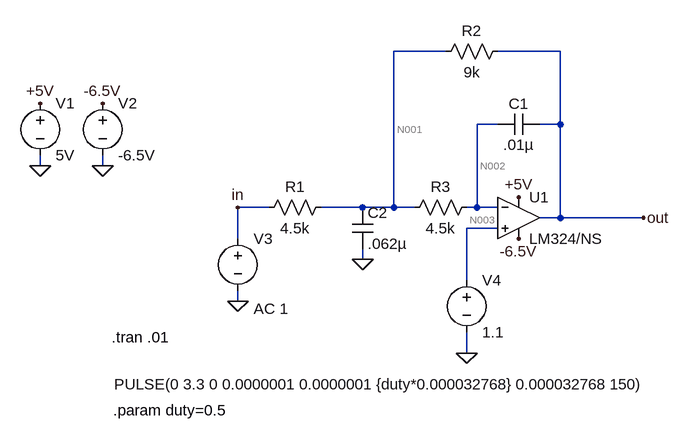
[diagram p0: schematic MFB_Duty_Sim.asc]
MFB_Duty_Sim.asc, the LTspice schematic file:
Version 4
SHEET 1 2296 768
WIRE 288 -32 208 -32
WIRE 464 -32 368 -32
WIRE 368 80 336 80
WIRE 464 80 464 -32
WIRE 464 80 432 80
WIRE -336 144 -336 128
WIRE -240 144 -240 128
WIRE 16 208 -32 208
WIRE 160 208 96 208
WIRE 208 208 208 -32
WIRE 208 208 160 208
WIRE 240 208 208 208
WIRE 336 208 336 80
WIRE 336 208 320 208
WIRE 368 208 336 208
WIRE 464 224 464 80
WIRE 464 224 432 224
WIRE 592 224 464 224
WIRE 368 240 320 240
WIRE -32 256 -32 208
WIRE 160 288 160 272
WIRE 320 320 320 240
WIRE -32 352 -32 336
WIRE 320 432 320 400
FLAG -240 144 0
FLAG -336 144 0
FLAG -336 48 +5V
FLAG 400 192 +5V
FLAG -240 48 -6.5V
FLAG 400 256 -6.5V
FLAG 160 288 0
FLAG -32 352 0
FLAG -32 208 in
FLAG 592 224 out
FLAG 320 432 0
SYMBOL ZZZ\\OpAmp\\LM324 400 224 R0
SYMATTR InstName U1
SYMBOL voltage -336 32 R0
WINDOW 123 0 0 Left 0
WINDOW 39 0 0 Left 0
SYMATTR InstName V1
SYMATTR Value 5V
SYMBOL voltage -240 32 R0
WINDOW 123 0 0 Left 0
WINDOW 39 0 0 Left 0
SYMATTR InstName V2
SYMATTR Value -6.5V
SYMBOL cap 432 64 R90
WINDOW 0 0 32 VBottom 2
WINDOW 3 32 32 VTop 2
SYMATTR InstName C1
SYMATTR Value .01µ
SYMBOL res 384 -48 R90
WINDOW 0 0 56 VBottom 2
WINDOW 3 32 56 VTop 2
SYMATTR InstName R2
SYMATTR Value 9k
SYMBOL res 336 192 R90
WINDOW 0 0 56 VBottom 2
WINDOW 3 32 56 VTop 2
SYMATTR InstName R3
SYMATTR Value 4.5k
SYMBOL cap 144 208 R0
SYMATTR InstName C2
SYMATTR Value .062µ
SYMBOL res 0 224 R270
WINDOW 0 32 56 VTop 2
WINDOW 3 0 56 VBottom 2
SYMATTR InstName R1
SYMATTR Value 4.5k
SYMBOL voltage -32 240 R0
WINDOW 3 -190 240 Left 2
WINDOW 123 24 124 Left 2
WINDOW 39 0 0 Left 0
SYMATTR InstName V3
SYMATTR Value PULSE(0 3.3 0 0.0000001 0.0000001 {duty*0.000032768} 0.000032768 150)
SYMATTR Value2 AC 1
SYMBOL voltage 320 304 R0
WINDOW 123 0 0 Left 0
WINDOW 39 0 0 Left 0
SYMATTR InstName V4
SYMATTR Value 1.1
TEXT -226 408 Left 2 !.tran .01
TEXT -224 520 Left 2 !.param duty=0.5

The netlist it stands for:
* MFB_Duty_Sim.asc
XU1 N003 N002 +5V -6.5V out LM324/NS  ; pins In+ In- V+ V- OUT
V1 +5V 0 5V
V2 -6.5V 0 -6.5V
C1 out N002 .01µ
R2 out N001 9k
R3 N002 N001 4.5k
C2 N001 0 .062µ
R1 in N001 4.5k
V3 in 0 PULSE(0 3.3 0 0.0000001 0.0000001 {duty*0.000032768} 0.000032768 150) AC 1
V4 N003 0 1.1
.tran .01
.param duty=0.5
.backanno
.end

* Results of the author's LTspice run, read from the files saved beside the schematic
* Operating Point, zero values left out:
*   V(n002) = 1.102 V
*   V(n003) = 1.1 V
*   V(+5v) = 5 V
*   V(-6.5v) = -6.5 V
*   V(out) = 3.305 V
*   V(n001) = 1.102 V
*   I(R1) = -244.9 µA
*   I(R3) = 37.93 nA
*   I(R2) = 244.8 µA
*   I(V4) = 51.98 nA
*   I(V3) = 244.9 µA
*   I(V2) = -24.42 µA
*   I(V1) = -220.5 µA
*   Ix(u1:1) = -51.98 nA
*   Ix(u1:2) = -37.93 nA
*   Ix(u1:99) = 220.5 µA
*   Ix(u1:50) = 24.42 µA
*   Ix(u1:28) = -244.8 µA
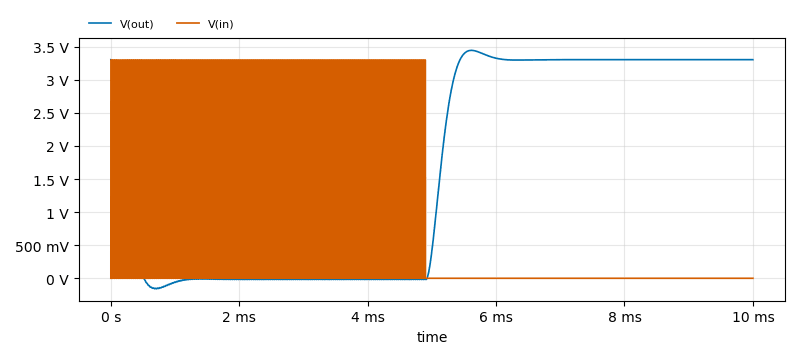
[diagram p1: Transient Analysis of MFB_Duty_Sim.asc, plotted from the saved traces]
* Transient Analysis, 1 run:
*   V(out): min -159.1 mV, max 3.446 V, average 1.673 V, rms 2.33 V, last 3.305 V
*   V(in): min 0 V, max 3.3 V, average 816 mV, rms 1.641 V, last 0 V